# Altium schematic sheet Top.SchDoc
size A3
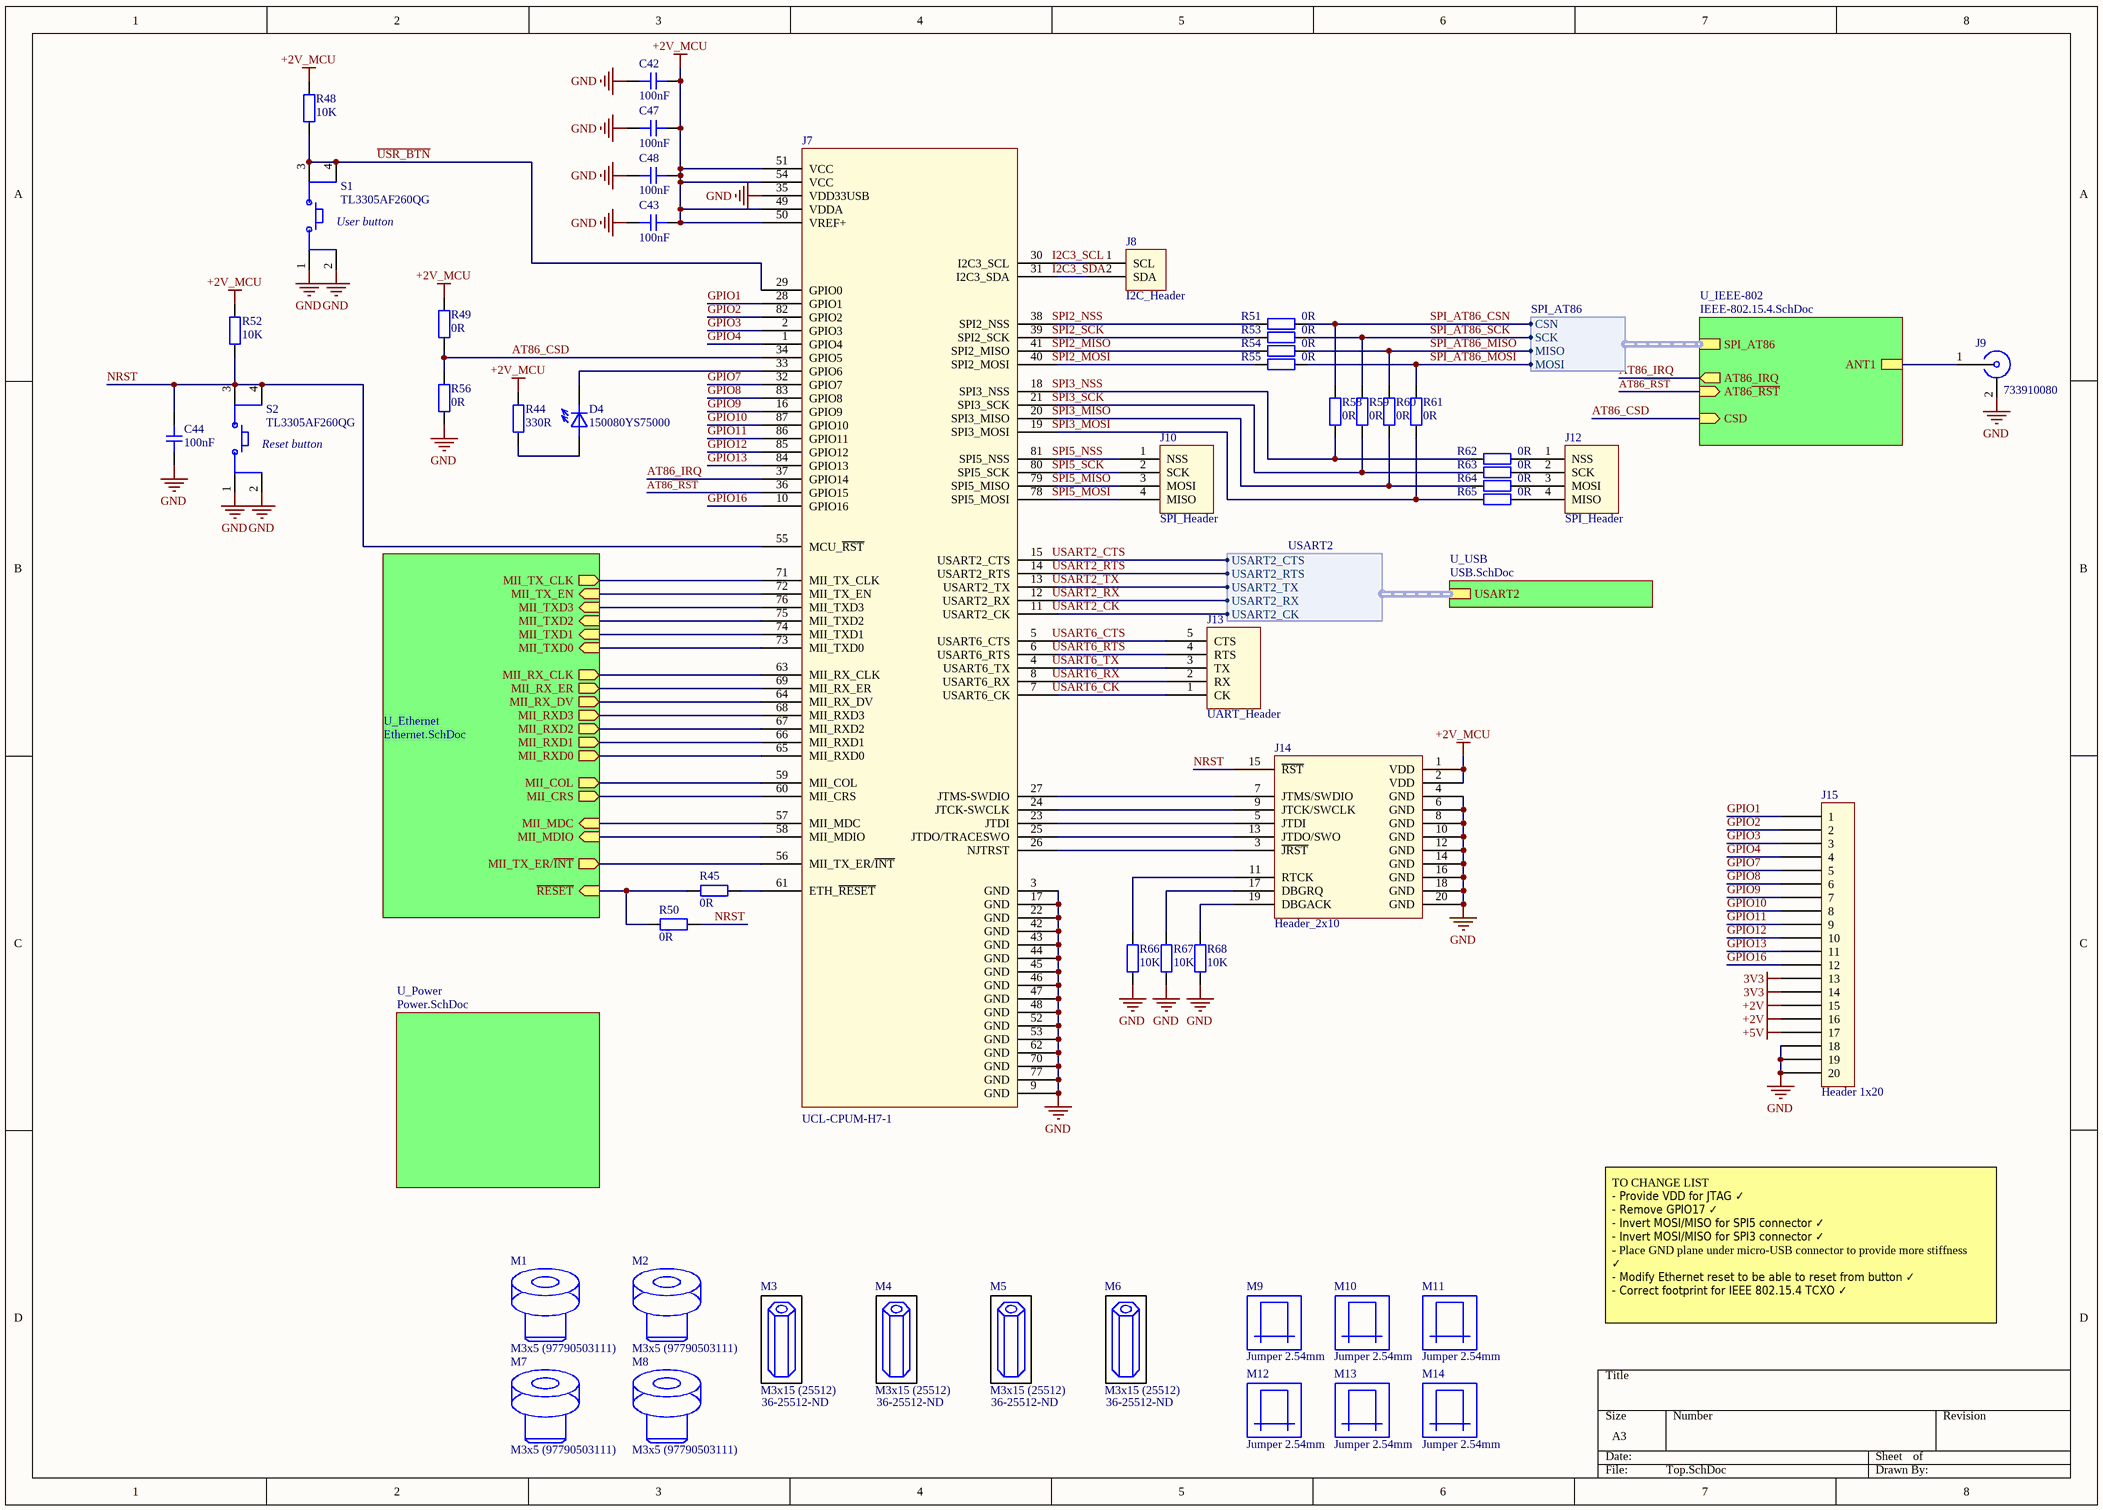
[diagram p0: Top.SchDoc]

## Parts
C42  value 100nF  [Capacitor-0603]  (hidden comment: C-100nF-0603)
C43  value 100nF  [Capacitor-0603]  (hidden comment: C-100nF-0603)
C44  value 100nF  [Capacitor-0603]  (hidden comment: C-100nF-0603)
C47  value 100nF  [Capacitor-0603]  (hidden comment: C-100nF-0603)
C48  value 100nF  [Capacitor-0603]  (hidden comment: C-100nF-0603)
D4  150080YS75000  [150080YS75000]
J7  UCL-CPUM-H7-1  [UCL-CPUM-H7-1]
J8  I2C_Header  [I2C_header]
J9  733910080  [SMA_733910080]
J10  SPI_Header  [SPI_Header]
J12  SPI_Header  [SPI_Header]
J13  UART_Header  [UART_Header]
J14  Header_2x10  [JTAG_Header]
J15  Header 1x20  [GPIO_Header]
M1  M3x5 (97790503111)  [Screw_M3]
M2  M3x5 (97790503111)  [Screw_M3]
M3  M3x15 (25512)  Supplier Part Number 1: 36-25512-ND
M4  M3x15 (25512)  Supplier Part Number 1: 36-25512-ND
M5  M3x15 (25512)  Supplier Part Number 1: 36-25512-ND
M6  M3x15 (25512)  Supplier Part Number 1: 36-25512-ND
M7  M3x5 (97790503111)  [Screw_M3]
M8  M3x5 (97790503111)  [Screw_M3]
M9  Jumper 2.54mm
M10  Jumper 2.54mm
M11  Jumper 2.54mm
M12  Jumper 2.54mm
M13  Jumper 2.54mm
M14  Jumper 2.54mm
R44  value 330R  [Resistor-0603]  (hidden comment: R-330R-0603)
R45  value 0R  [Resistor-0603]  (hidden comment: R-0R-0603)
R48  value 10K  [Resistor-0603]  (hidden comment: R-10K-0603)
R49  value 0R  [Resistor-0603]  (hidden comment: R-0R-0603)
R50  value 0R  [Resistor-0603]  (hidden comment: R-0R-0603)
R51  value 0R  [Resistor-0603]  (hidden comment: R-0R-0603)
R52  value 10K  [Resistor-0603]  (hidden comment: R-10K-0603)
R53  value 0R  [Resistor-0603]  (hidden comment: R-0R-0603)
R54  value 0R  [Resistor-0603]  (hidden comment: R-0R-0603)
R55  value 0R  [Resistor-0603]  (hidden comment: R-0R-0603)
R56  value 0R  [Resistor-0603]  (hidden comment: R-0R-0603)
R58  value 0R  [Resistor-0603]  (hidden comment: R-0R-0603)
R59  value 0R  [Resistor-0603]  (hidden comment: R-0R-0603)
R60  value 0R  [Resistor-0603]  (hidden comment: R-0R-0603)
R61  value 0R  [Resistor-0603]  (hidden comment: R-0R-0603)
R62  value 0R  [Resistor-0603]  (hidden comment: R-0R-0603)
R63  value 0R  [Resistor-0603]  (hidden comment: R-0R-0603)
R64  value 0R  [Resistor-0603]  (hidden comment: R-0R-0603)
R65  value 0R  [Resistor-0603]  (hidden comment: R-0R-0603)
R66  value 10K  [Resistor-0603]  (hidden comment: R-10K-0603)
R67  value 10K  [Resistor-0603]  (hidden comment: R-10K-0603)
R68  value 10K  [Resistor-0603]  (hidden comment: R-10K-0603)
S1  TL3305AF260QG  [TL3305AF260QG]
S2  TL3305AF260QG  [TL3305AF260QG]

## Sub-sheets
U_Ethernet = Ethernet.SchDoc: MII_RX_CLK (out), MII_RXD3 (out), MII_RXD2 (out), MII_RXD1 (out), MII_RXD0 (out), MII_RX_DV (out), MII_RX_ER (out), MII_TX_CLK (out), MII_TX_EN (in), MII_TXD0 (in), MII_TXD1 (in), MII_TXD2 (in), MII_TXD3 (in), MII_TX_ER/~{INT} (out), MII_MDIO (in), MII_MDC (in), MII_CRS (out), MII_COL (out), ~{RESET} (in)
U_IEEE-802 = IEEE-802.15.4.SchDoc: AT86_IRQ (out), AT86~{_RST} (in), SPI_AT86 (harness SPI_AT86), ANT1, CSD (in)
U_Power = Power.SchDoc: no entries
U_USB = USB.SchDoc: USART2 (harness USART2)

## Harnesses
USART2: USART2_CTS, USART2_RTS, USART2_TX, USART2_RX, USART2_CK
SPI_AT86: CSN, SCK, MISO, MOSI

## Nets
3V3: J15.13 J15.14
+2V: J15.15 J15.16
+2V_MCU: C42.2 C43.2 C47.2 C48.2 J7.49(VDDA) J7.50(VREF+) J7.51(VCC) J7.54(VCC) J14.1(VDD) J14.2(VDD) R44.2 R48.2 R49.2 R52.2
+5V: J15.17
GND: C42.1 C43.1 C44.1 C47.1 C48.1 J7.3(GND) J7.9(GND) J7.17(GND) J7.22(GND) J7.35(VDD33USB) J7.42(GND) J7.43(GND) J7.44(GND) J7.45(GND) J7.46(GND) J7.47(GND) J7.48(GND) J7.52(GND) J7.53(GND) J7.62(GND) J7.70(GND) J7.77(GND) J9.2(GND) J14.4(GND) J14.6(GND) J14.8(GND) J14.10(GND) J14.12(GND) J14.14(GND) J14.16(GND) J14.18(GND) J14.20(GND) J15.18 J15.19 J15.20 R56.1 R66.1 R67.1 R68.1 S1.1 S1.2 S2.1 S2.2
AT86~{_RST}: J7.36(GPIO15) ; sheet U_IEEE-802/AT86~{_RST}
AT86_CSD: J7.34(GPIO5) R49.1 R56.2 ; sheet U_IEEE-802/CSD
AT86_IRQ: J7.37(GPIO14) ; sheet U_IEEE-802/AT86_IRQ
GPIO1: J7.28(GPIO1) J15.1
GPIO2: J7.82(GPIO2) J15.2
GPIO3: J7.2(GPIO3) J15.3
GPIO4: J7.1(GPIO4) J15.4
GPIO7: J7.32(GPIO7) J15.5
GPIO8: J7.83(GPIO8) J15.6
GPIO9: J7.16(GPIO9) J15.7
GPIO10: J7.87(GPIO10) J15.8
GPIO11: J7.86(GPIO11) J15.9
GPIO12: J7.85(GPIO12) J15.10
GPIO13: J7.84(GPIO13) J15.11
GPIO16: J7.10(GPIO16) J15.12
NRST: C44.2 J7.55(MCU_~{RST}) J14.15(~{RST}) R50.2 R52.1 S2.3 S2.4
SPI_AT86_CSN: R51.2 R58.2 ; sheet U_IEEE-802/SPI_AT86.CSN
SPI_AT86_MISO: R54.2 R60.2 ; sheet U_IEEE-802/SPI_AT86.MISO
SPI_AT86_MOSI: R55.2 R61.2 ; sheet U_IEEE-802/SPI_AT86.MOSI
SPI_AT86_SCK: R53.2 R59.2 ; sheet U_IEEE-802/SPI_AT86.SCK
~{USR_BTN}: J7.29(GPIO0) R48.1 S1.3 S1.4
NetD4_1: D4.1 J7.33(GPIO6)
NetD4_2: D4.2 R44.1
NetJ7_4: J7.4(USART6_TX) J13.3(TX)
NetJ7_5: J7.5(USART6_CTS) J13.5(CTS)
NetJ7_6: J7.6(USART6_RTS) J13.4(RTS)
NetJ7_7: J7.7(USART6_CK) J13.1(CK)
NetJ7_8: J7.8(USART6_RX) J13.2(RX)
NetJ7_11: J7.11(USART2_CK) ; sheet U_USB/USART2.USART2_CK
NetJ7_12: J7.12(USART2_RX) ; sheet U_USB/USART2.USART2_RX
NetJ7_13: J7.13(USART2_TX) ; sheet U_USB/USART2.USART2_TX
NetJ7_14: J7.14(USART2_RTS) ; sheet U_USB/USART2.USART2_RTS
NetJ7_15: J7.15(USART2_CTS) ; sheet U_USB/USART2.USART2_CTS
NetJ7_18: J7.18(SPI3_NSS) R58.1 R62.1
NetJ7_19: J7.19(SPI3_MOSI) R61.1 R65.1
NetJ7_20: J7.20(SPI3_MISO) R60.1 R64.1
NetJ7_21: J7.21(SPI3_SCK) R59.1 R63.1
NetJ7_23: J7.23(JTDI) J14.5(JTDI)
NetJ7_24: J7.24(JTCK-SWCLK) J14.9(JTCK/SWCLK)
NetJ7_25: J7.25(JTDO/TRACESWO) J14.13(JTDO/SWO)
NetJ7_26: J7.26(NJTRST) J14.3(~{JRST})
NetJ7_27: J7.27(JTMS-SWDIO) J14.7(JTMS/SWDIO)
NetJ7_30: J7.30(I2C3_SCL) J8.1(SCL)
NetJ7_31: J7.31(I2C3_SDA) J8.2(SDA)
NetJ7_38: J7.38(SPI2_NSS) R51.1
NetJ7_39: J7.39(SPI2_SCK) R53.1
NetJ7_40: J7.40(SPI2_MOSI) R55.1
NetJ7_41: J7.41(SPI2_MISO) R54.1
NetJ7_56: J7.56(MII_TX_ER/~{INT}) ; sheet U_Ethernet/MII_TX_ER/~{INT}
NetJ7_57: J7.57(MII_MDC) ; sheet U_Ethernet/MII_MDC
NetJ7_58: J7.58(MII_MDIO) ; sheet U_Ethernet/MII_MDIO
NetJ7_59: J7.59(MII_COL) ; sheet U_Ethernet/MII_COL
NetJ7_60: J7.60(MII_CRS) ; sheet U_Ethernet/MII_CRS
NetJ7_61: J7.61(ETH_~{RESET}) R45.2
NetJ7_63: J7.63(MII_RX_CLK) ; sheet U_Ethernet/MII_RX_CLK
NetJ7_64: J7.64(MII_RX_DV) ; sheet U_Ethernet/MII_RX_DV
NetJ7_65: J7.65(MII_RXD0) ; sheet U_Ethernet/MII_RXD0
NetJ7_66: J7.66(MII_RXD1) ; sheet U_Ethernet/MII_RXD1
NetJ7_67: J7.67(MII_RXD2) ; sheet U_Ethernet/MII_RXD2
NetJ7_68: J7.68(MII_RXD3) ; sheet U_Ethernet/MII_RXD3
NetJ7_69: J7.69(MII_RX_ER) ; sheet U_Ethernet/MII_RX_ER
NetJ7_71: J7.71(MII_TX_CLK) ; sheet U_Ethernet/MII_TX_CLK
NetJ7_72: J7.72(MII_TX_EN) ; sheet U_Ethernet/MII_TX_EN
NetJ7_73: J7.73(MII_TXD0) ; sheet U_Ethernet/MII_TXD0
NetJ7_74: J7.74(MII_TXD1) ; sheet U_Ethernet/MII_TXD1
NetJ7_75: J7.75(MII_TXD2) ; sheet U_Ethernet/MII_TXD2
NetJ7_76: J7.76(MII_TXD3) ; sheet U_Ethernet/MII_TXD3
NetJ7_78: J7.78(SPI5_MOSI) J10.4(MISO)
NetJ7_79: J7.79(SPI5_MISO) J10.3(MOSI)
NetJ7_80: J7.80(SPI5_SCK) J10.2(SCK)
NetJ7_81: J7.81(SPI5_NSS) J10.1(NSS)
NetJ9_1: J9.1(SIG) ; sheet U_IEEE-802/ANT1
NetJ12_1: J12.1(NSS) R62.2
NetJ12_2: J12.2(SCK) R63.2
NetJ12_3: J12.3(MOSI) R64.2
NetJ12_4: J12.4(MISO) R65.2
NetJ14_11: J14.11(RTCK) R66.2
NetJ14_17: J14.17(DBGRQ) R67.2
NetJ14_19: J14.19(DBGACK) R68.2
NetR45_1: R45.1 R50.1 ; sheet U_Ethernet/~{RESET}

## Notes on the sheet
- (near S1) User button
- (near S2) Reset button
- TO CHANGE LIST
  - Provide VDD for JTAG ✓
  - Remove GPIO17 ✓
  - Invert MOSI/MISO for SPI5 connector ✓
  - Invert MOSI/MISO for SPI3 connector ✓
  - Place GND plane under micro-USB connector to provide more stiffness ✓
  - Modify Ethernet reset to be able to reset from button ✓
  - Correct footprint for IEEE 802.15.4 TCXO ✓
- Labels drawn without touching a wire or pin: I2C3_SCL, I2C3_SDA, SPI2_MISO, SPI2_MOSI, SPI2_NSS, SPI2_SCK, SPI3_MISO, SPI3_MOSI, SPI3_NSS, SPI3_SCK, SPI5_MISO, SPI5_MOSI, SPI5_NSS, SPI5_SCK, USART2_CK, USART2_CTS, USART2_RTS, USART2_RX, USART2_TX, USART6_CK, USART6_CTS, USART6_RTS, USART6_RX, USART6_TX

## Library data of the parts
J9 = SMA_733910080: Supplier 1: Digi-Key; Supplier Part Number 1: WM4088-ND
J14 = JTAG_Header: Supplier 1: Digi-Key; Supplier Part Number 1: 2057-PH2-20-UA-ND
J15 = GPIO_Header: Supplier 1: Digi-Key; Supplier Part Number 1: S7018-ND
M1 M2 M7 M8 = Screw_M3x5: Supplier 1: Digi-Key; Supplier Part Number 1: 732-13703-ND
M3-M6 = Standoff_hex_M3_15mm_25512: Supplier 1: Digi-Key
M9-M14 = QPC02SXGN-RC: Supplier 1: Digi-Key; Supplier Part Number 1: S9337-ND
C42-C44 C47 C48 = C-100nF-0603: Supplier 1: Digi-Key; Supplier Part Number 1: 1276-1006-1-ND
D4 = 150080YS75000: Supplier 1: Digi-Key; Supplier Part Number 1: 732-4987-1-ND
J8 = I2C_Header: Supplier 1: Digi-Key; Supplier Part Number 1: SAM1222-02-ND
J10 J12 = SPI_Header: Supplier 1: Digi-Key; Supplier Part Number 1: SAM1213-04-ND
J13 = UART_Header: Supplier 1: Digi-Key; Supplier Part Number 1: SAM1213-05-ND
R44 = R-330R-0603: Supplier 1: Digi-Key; Supplier Part Number 1: 311-330HRCT-ND
R45 R49-R51 R53-R56 R58-R65 = R-0R-0603: Supplier 1: Digi-Key; Supplier Part Number 1: RMCF0603ZT0R00CT-ND
R48 R52 R66-R68 = R-10K-0603: Supplier 1: Digi-Key; Supplier Part Number 1: 311-10.0KHRCT-ND
S1 S2 = TL3305AF260QG: Supplier 1: Digi-Key; Supplier Part Number 1: EG5353CT-ND